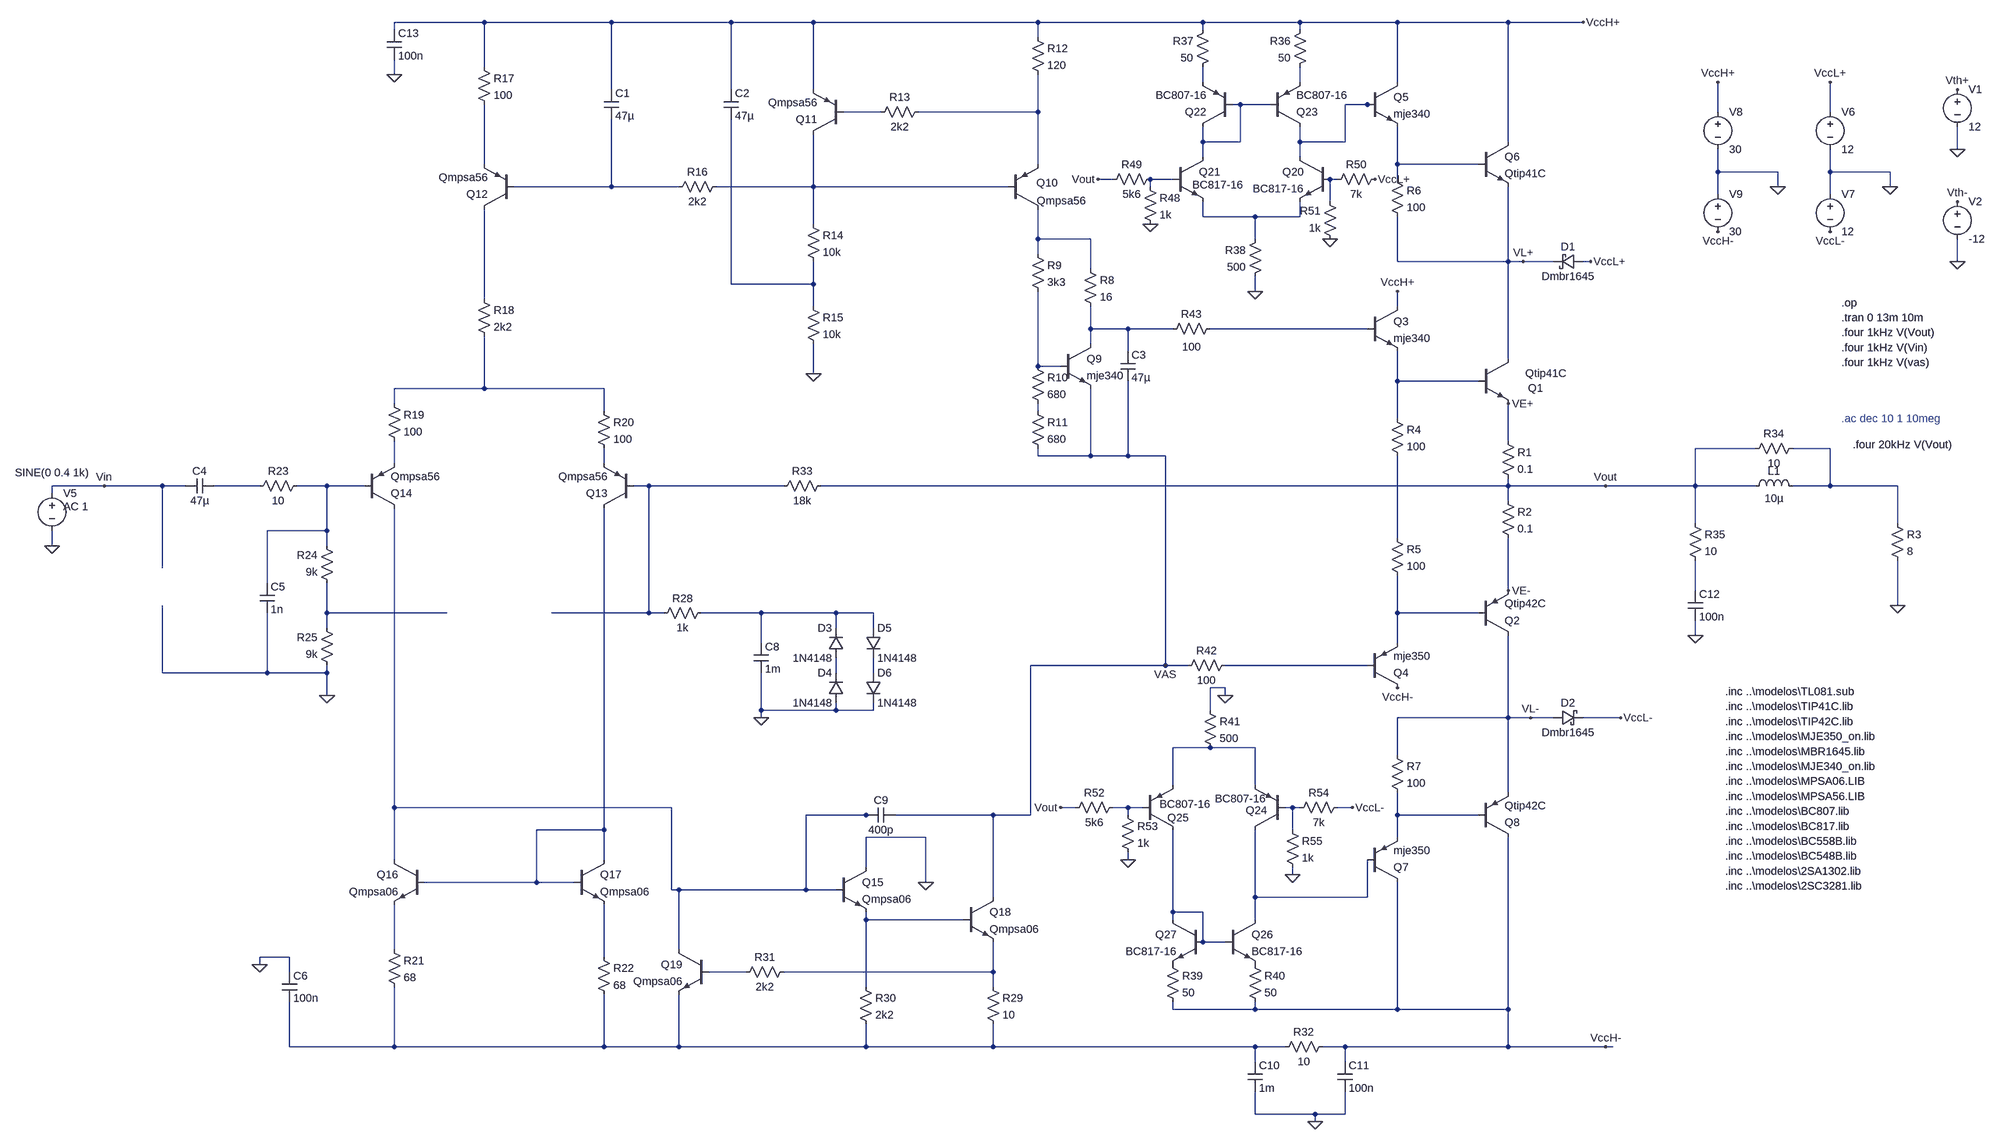
[diagram p0: schematic 3.1_cto_completo.asc]
3.1_cto_completo.asc, the LTspice schematic file:
Version 4
SHEET 1 1432 1652
WIRE -1984 -720 -2176 -720
WIRE -1712 -720 -1984 -720
WIRE -1456 -720 -1712 -720
WIRE -1280 -720 -1456 -720
WIRE -800 -720 -1280 -720
WIRE -448 -720 -800 -720
WIRE -240 -720 -448 -720
WIRE -32 -720 -240 -720
WIRE 240 -720 -32 -720
WIRE 400 -720 240 -720
WIRE -2176 -704 -2176 -720
WIRE -448 -704 -448 -720
WIRE -240 -704 -240 -720
WIRE -800 -688 -800 -720
WIRE -1984 -624 -1984 -720
WIRE -2176 -608 -2176 -640
WIRE -448 -592 -448 -624
WIRE -240 -592 -240 -624
WIRE -32 -592 -32 -720
WIRE -1712 -576 -1712 -720
WIRE -1456 -576 -1456 -720
WIRE -1280 -576 -1280 -720
WIRE -800 -544 -800 -608
WIRE -368 -544 -384 -544
WIRE -304 -544 -368 -544
WIRE -96 -544 -144 -544
WIRE -80 -544 -96 -544
WIRE -1136 -528 -1216 -528
WIRE -960 -528 -1056 -528
WIRE -800 -528 -800 -544
WIRE -800 -528 -960 -528
WIRE 688 -528 688 -592
WIRE 928 -528 928 -592
WIRE -448 -464 -448 -496
WIRE -368 -464 -368 -544
WIRE -368 -464 -448 -464
WIRE -240 -464 -240 -496
WIRE -224 -464 -240 -464
WIRE -144 -464 -144 -544
WIRE -144 -464 -224 -464
WIRE 240 -464 240 -720
WIRE 1200 -448 1200 -496
WIRE -448 -432 -448 -464
WIRE -240 -432 -240 -464
WIRE -1984 -416 -1984 -544
WIRE -800 -416 -800 -528
WIRE -32 -416 -32 -496
WIRE 64 -416 -32 -416
WIRE 176 -416 64 -416
WIRE 688 -400 688 -448
WIRE 816 -400 688 -400
WIRE 928 -400 928 -448
WIRE 1056 -400 928 -400
WIRE -640 -384 -672 -384
WIRE -528 -384 -560 -384
WIRE -512 -384 -528 -384
WIRE -160 -384 -176 -384
WIRE -32 -384 -32 -416
WIRE -1712 -368 -1712 -512
WIRE -1712 -368 -1920 -368
WIRE -1568 -368 -1712 -368
WIRE -1280 -368 -1280 -480
WIRE -1280 -368 -1488 -368
WIRE -864 -368 -1280 -368
WIRE -560 -368 -560 -384
WIRE -176 -368 -176 -384
WIRE 816 -368 816 -400
WIRE 1056 -368 1056 -400
WIRE 688 -352 688 -400
WIRE 928 -352 928 -400
WIRE -176 -336 -176 -368
WIRE -240 -320 -240 -336
WIRE -448 -304 -448 -336
WIRE -336 -304 -448 -304
WIRE -240 -304 -240 -320
WIRE -240 -304 -336 -304
WIRE -1280 -288 -1280 -368
WIRE -336 -272 -336 -304
WIRE -800 -256 -800 -320
WIRE -688 -256 -800 -256
WIRE -336 -256 -336 -272
WIRE -800 -224 -800 -256
WIRE -32 -208 -32 -304
WIRE 160 -208 -32 -208
WIRE 240 -208 240 -368
WIRE 240 -208 160 -208
WIRE 272 -208 240 -208
WIRE 336 -208 272 -208
WIRE 416 -208 400 -208
WIRE 1200 -208 1200 -256
WIRE -688 -192 -688 -256
WIRE -1456 -160 -1456 -512
WIRE -1280 -160 -1280 -208
WIRE -1280 -160 -1456 -160
WIRE -336 -144 -336 -176
WIRE -1984 -128 -1984 -320
WIRE -1280 -112 -1280 -160
WIRE -32 -112 -32 -144
WIRE -688 -64 -688 -112
WIRE -608 -64 -688 -64
WIRE -512 -64 -608 -64
WIRE -224 -64 -432 -64
WIRE -96 -64 -224 -64
WIRE -688 -32 -688 -64
WIRE -608 -16 -608 -64
WIRE 240 0 240 -208
WIRE -800 16 -800 -144
WIRE -752 16 -800 16
WIRE -1280 32 -1280 -32
WIRE -32 48 -32 -16
WIRE 80 48 -32 48
WIRE 176 48 80 48
WIRE -1984 64 -1984 -48
WIRE -1984 64 -2176 64
WIRE -1728 64 -1984 64
WIRE -2176 96 -2176 64
WIRE -1728 112 -1728 64
WIRE -800 112 -800 96
WIRE -32 128 -32 48
WIRE 240 160 240 96
WIRE 240 176 240 160
WIRE 768 192 640 192
WIRE 928 192 848 192
WIRE -800 208 -800 192
WIRE -688 208 -688 64
WIRE -688 208 -800 208
WIRE -608 208 -608 48
WIRE -608 208 -688 208
WIRE -528 208 -608 208
WIRE -2176 224 -2176 176
WIRE -1728 224 -1728 192
WIRE -2816 272 -2928 272
WIRE -2672 272 -2816 272
WIRE -2624 272 -2672 272
WIRE -2464 272 -2560 272
WIRE -2320 272 -2384 272
WIRE -2240 272 -2320 272
WIRE -1632 272 -1664 272
WIRE -1344 272 -1632 272
WIRE 240 272 240 256
WIRE 240 272 -1264 272
WIRE 320 272 240 272
WIRE 448 272 320 272
WIRE 640 272 640 192
WIRE 640 272 448 272
WIRE 768 272 640 272
WIRE 928 272 928 192
WIRE 928 272 848 272
WIRE 1072 272 928 272
WIRE -2928 288 -2928 272
WIRE 240 304 240 272
WIRE 640 352 640 272
WIRE 1072 352 1072 272
WIRE -2320 368 -2320 272
WIRE -2320 368 -2448 368
WIRE -32 384 -32 208
WIRE -2928 400 -2928 368
WIRE -2320 400 -2320 368
WIRE 240 432 240 384
WIRE -2672 448 -2672 272
WIRE -2448 480 -2448 368
WIRE 240 496 240 432
WIRE 640 496 640 432
WIRE 1072 528 1072 432
WIRE -2320 544 -2320 480
WIRE -2064 544 -2320 544
WIRE -1632 544 -1632 272
WIRE -1632 544 -1840 544
WIRE -1600 544 -1632 544
WIRE -1392 544 -1520 544
WIRE -1232 544 -1392 544
WIRE -1152 544 -1232 544
WIRE -32 544 -32 464
WIRE 80 544 -32 544
WIRE 176 544 80 544
WIRE -2320 576 -2320 544
WIRE -1232 576 -1232 544
WIRE -1152 576 -1152 544
WIRE 640 592 640 560
WIRE -1392 608 -1392 544
WIRE -32 608 -32 544
WIRE -528 656 -528 208
WIRE -528 656 -816 656
WIRE -480 656 -528 656
WIRE -96 656 -400 656
WIRE -2672 672 -2672 528
WIRE -2448 672 -2448 544
WIRE -2448 672 -2672 672
WIRE -2320 672 -2320 656
WIRE -2320 672 -2448 672
WIRE -1232 672 -1232 640
WIRE -1152 672 -1152 640
WIRE -400 704 -432 704
WIRE -2320 720 -2320 672
WIRE -400 720 -400 704
WIRE -1392 752 -1392 672
WIRE -1232 752 -1232 736
WIRE -1232 752 -1392 752
WIRE -1152 752 -1152 736
WIRE -1152 752 -1232 752
WIRE -432 752 -432 704
WIRE -1392 768 -1392 752
WIRE 64 768 -32 768
WIRE 240 768 240 592
WIRE 240 768 64 768
WIRE 288 768 240 768
WIRE 336 768 288 768
WIRE 480 768 400 768
WIRE -432 832 -512 832
WIRE -336 832 -432 832
WIRE -512 848 -512 832
WIRE -336 848 -336 832
WIRE -32 848 -32 768
WIRE -512 912 -512 848
WIRE -336 912 -336 848
WIRE 240 928 240 768
WIRE -2176 960 -2176 320
WIRE -1584 960 -2176 960
WIRE -720 960 -752 960
WIRE -608 960 -640 960
WIRE -576 960 -608 960
WIRE -256 960 -272 960
WIRE -240 960 -256 960
WIRE -128 960 -160 960
WIRE -1168 976 -1296 976
WIRE -1152 976 -1168 976
WIRE -896 976 -1104 976
WIRE -816 976 -816 656
WIRE -816 976 -896 976
WIRE -608 976 -608 960
WIRE -32 976 -32 928
WIRE 48 976 -32 976
WIRE 176 976 48 976
WIRE -1728 1008 -1728 320
WIRE -1728 1008 -1872 1008
WIRE -256 1008 -256 960
WIRE -1040 1024 -1168 1024
WIRE -32 1024 -32 976
WIRE -2176 1072 -2176 960
WIRE -1728 1072 -1728 1008
WIRE -608 1072 -608 1056
WIRE -1168 1088 -1168 1024
WIRE -256 1104 -256 1088
WIRE -1872 1120 -1872 1008
WIRE -1872 1120 -2112 1120
WIRE -1792 1120 -1872 1120
WIRE -1040 1120 -1040 1024
WIRE -1584 1136 -1584 960
WIRE -1568 1136 -1584 1136
WIRE -1296 1136 -1296 976
WIRE -1296 1136 -1568 1136
WIRE -1232 1136 -1296 1136
WIRE -896 1152 -896 976
WIRE -336 1152 -336 1008
WIRE -96 1152 -96 1072
WIRE -96 1152 -336 1152
WIRE -512 1184 -512 1008
WIRE -448 1184 -512 1184
WIRE -1168 1200 -1168 1184
WIRE -960 1200 -1168 1200
WIRE -512 1200 -512 1184
WIRE -336 1200 -336 1152
WIRE -448 1248 -448 1184
WIRE -400 1248 -448 1248
WIRE -2176 1264 -2176 1168
WIRE -1568 1264 -1568 1136
WIRE -2400 1280 -2464 1280
WIRE -1728 1280 -1728 1168
WIRE -2464 1296 -2464 1280
WIRE -2400 1312 -2400 1280
WIRE -1424 1312 -1504 1312
WIRE -896 1312 -896 1248
WIRE -896 1312 -1344 1312
WIRE -1168 1344 -1168 1200
WIRE -896 1344 -896 1312
WIRE -512 1392 -512 1376
WIRE -336 1392 -336 1376
WIRE -336 1392 -512 1392
WIRE -32 1392 -32 1120
WIRE -32 1392 -336 1392
WIRE 240 1392 240 1024
WIRE 240 1392 -32 1392
WIRE -2400 1472 -2400 1376
WIRE -2176 1472 -2176 1344
WIRE -2176 1472 -2400 1472
WIRE -1728 1472 -1728 1360
WIRE -1728 1472 -2176 1472
WIRE -1568 1472 -1568 1360
WIRE -1568 1472 -1728 1472
WIRE -1168 1472 -1168 1424
WIRE -1168 1472 -1568 1472
WIRE -896 1472 -896 1424
WIRE -896 1472 -1168 1472
WIRE -336 1472 -896 1472
WIRE -272 1472 -336 1472
WIRE -144 1472 -192 1472
WIRE 240 1472 240 1392
WIRE 240 1472 -144 1472
WIRE 448 1472 240 1472
WIRE 464 1472 448 1472
WIRE -336 1504 -336 1472
WIRE -144 1504 -144 1472
WIRE -336 1616 -336 1568
WIRE -208 1616 -336 1616
WIRE -144 1616 -144 1568
WIRE -144 1616 -208 1616
WIRE -208 1632 -208 1616
FLAG 1072 528 0
FLAG -2928 400 0
FLAG 448 272 Vout
FLAG -2816 272 Vin
FLAG 816 -368 0
FLAG 688 -592 VccH+
FLAG 688 -272 VccH-
FLAG 400 -720 VccH+
FLAG 448 1472 VccH-
FLAG 1056 -368 0
FLAG 928 -592 VccL+
FLAG 928 -272 VccL-
FLAG 416 -208 VccL+
FLAG 480 768 VccL-
FLAG 1200 -448 0
FLAG 1200 -576 Vth+
FLAG 1200 -208 0
FLAG 1200 -336 Vth-
FLAG -1280 32 0
FLAG -2320 720 0
FLAG -2464 1296 0
FLAG -1392 768 0
FLAG -1040 1120 0
FLAG -208 1632 0
FLAG -528 656 VAS
FLAG 640 592 0
FLAG -2176 -608 0
FLAG -32 -144 VccH+
FLAG -32 704 VccH-
FLAG 240 96 VE+
FLAG 240 496 VE-
FLAG -80 -384 VccL+
FLAG -672 -384 Vout
FLAG -560 -288 0
FLAG -176 -256 0
FLAG -336 -144 0
FLAG -128 960 VccL-
FLAG -752 960 Vout
FLAG -608 1072 0
FLAG -256 1104 0
FLAG -400 720 0
FLAG 272 -208 VL+
FLAG 288 768 VL-
DATAFLAG 320 272 ""
DATAFLAG 240 160 "round(Ie(Q1)*10k)/10k"
DATAFLAG 240 432 "round(Ie(Q2)*10k)/10k"
DATAFLAG 80 48 ""
DATAFLAG 80 544 ""
DATAFLAG 64 768 ""
DATAFLAG 160 -208 ""
DATAFLAG -896 976 ""
DATAFLAG -960 -528 ""
DATAFLAG -800 -544 "I(R12)"
DATAFLAG -336 -304 ""
DATAFLAG -240 -320 "round(10k*Ie(Q12))/10k"
DATAFLAG -224 -464 ""
DATAFLAG -528 -384 ""
DATAFLAG -176 -368 ""
DATAFLAG -336 -272 "round(I(R19)*10k)/10k"
DATAFLAG -512 848 ""
DATAFLAG -336 848 "Ie(Q16)"
DATAFLAG 64 -416 ""
DATAFLAG -224 -64 ""
DATAFLAG 48 976 ""
SYMBOL npn 176 0 R0
WINDOW 3 100 31 Left 2
WINDOW 0 106 63 Left 2
SYMATTR Value Qtip41C
SYMATTR InstName Q1
SYMBOL npn -96 -112 R0
SYMATTR InstName Q3
SYMATTR Value mje340
SYMBOL pnp 176 592 M180
SYMATTR InstName Q2
SYMATTR Value Qtip42C
SYMBOL res 224 160 R0
SYMATTR InstName R1
SYMATTR Value 0.1
SYMBOL res 224 288 R0
SYMATTR InstName R2
SYMATTR Value 0.1
SYMBOL res 1056 336 R0
SYMATTR InstName R3
SYMATTR Value 8
SYMBOL pnp -96 704 M180
SYMATTR InstName Q4
SYMATTR Value mje350
SYMBOL res -48 112 R0
SYMATTR InstName R4
SYMATTR Value 100
SYMBOL res -48 368 R0
SYMATTR InstName R5
SYMATTR Value 100
SYMBOL voltage -2928 272 R0
WINDOW 3 -79 -28 Left 2
WINDOW 123 24 44 Left 2
WINDOW 39 0 0 Left 2
SYMATTR Value SINE(0 0.4 1k)
SYMATTR Value2 AC 1
SYMATTR InstName V5
SYMBOL res -48 -400 R0
SYMATTR InstName R6
SYMATTR Value 100
SYMBOL npn -96 -592 R0
SYMATTR InstName Q5
SYMATTR Value mje340
SYMBOL npn 176 -464 R0
SYMATTR InstName Q6
SYMATTR Value Qtip41C
SYMBOL schottky 400 -224 R90
WINDOW 0 0 32 VBottom 2
WINDOW 3 32 32 VTop 2
SYMATTR InstName D1
SYMATTR Value Dmbr1645
SYMBOL schottky 336 784 R270
WINDOW 0 32 32 VTop 2
WINDOW 3 0 32 VBottom 2
SYMATTR InstName D2
SYMATTR Value Dmbr1645
SYMBOL pnp 176 1024 M180
SYMATTR InstName Q8
SYMATTR Value Qtip42C
SYMBOL pnp -96 1120 M180
SYMATTR InstName Q7
SYMATTR Value mje350
SYMBOL res -48 832 R0
SYMATTR InstName R7
SYMATTR Value 100
SYMBOL voltage 688 -544 R0
WINDOW 123 0 0 Left 2
WINDOW 39 0 0 Left 2
SYMATTR InstName V8
SYMATTR Value 30
SYMBOL voltage 688 -368 R0
WINDOW 123 0 0 Left 2
WINDOW 39 0 0 Left 2
SYMATTR InstName V9
SYMATTR Value 30
SYMBOL voltage 928 -544 R0
WINDOW 123 0 0 Left 2
WINDOW 39 0 0 Left 2
SYMATTR InstName V6
SYMATTR Value 12
SYMBOL voltage 928 -368 R0
WINDOW 123 0 0 Left 2
WINDOW 39 0 0 Left 2
SYMATTR InstName V7
SYMATTR Value 12
SYMBOL voltage 1200 -592 R0
WINDOW 123 0 0 Left 2
WINDOW 39 0 0 Left 2
SYMATTR InstName V1
SYMATTR Value 12
SYMBOL voltage 1200 -352 R0
WINDOW 123 0 0 Left 2
WINDOW 39 0 0 Left 2
SYMATTR InstName V2
SYMATTR Value -12
SYMBOL npn -752 -32 R0
SYMATTR InstName Q9
SYMATTR Value mje340
SYMBOL res -704 -208 R0
SYMATTR InstName R8
SYMATTR Value 16
SYMBOL res -816 -240 R0
SYMATTR InstName R9
SYMATTR Value 3k3
SYMBOL res -816 0 R0
SYMATTR InstName R10
SYMATTR Value 680
SYMBOL res -816 96 R0
SYMATTR InstName R11
SYMATTR Value 680
SYMBOL pnp -864 -320 M180
WINDOW 0 60 56 Left 2
WINDOW 3 61 18 Left 2
SYMATTR InstName Q10
SYMATTR Value Qmpsa56
SYMBOL res -816 -704 R0
SYMATTR InstName R12
SYMATTR Value 120
SYMBOL res -1040 -544 R90
WINDOW 0 0 56 VBottom 2
WINDOW 3 32 56 VTop 2
SYMATTR InstName R13
SYMATTR Value 2k2
SYMBOL pnp -1216 -480 R180
SYMATTR InstName Q11
SYMATTR Value Qmpsa56
SYMBOL res -1296 -304 R0
SYMATTR InstName R14
SYMATTR Value 10k
SYMBOL res -1296 -128 R0
SYMATTR InstName R15
SYMATTR Value 10k
SYMBOL res -1472 -384 R90
WINDOW 0 0 56 VBottom 2
WINDOW 3 32 56 VTop 2
SYMATTR InstName R16
SYMATTR Value 2k2
SYMBOL cap -1728 -576 R0
SYMATTR InstName C1
SYMATTR Value 47µ
SYMBOL cap -1472 -576 R0
SYMATTR InstName C2
SYMATTR Value 47µ
SYMBOL cap -624 -16 R0
SYMATTR InstName C3
SYMATTR Value 47µ
SYMBOL res -2000 -640 R0
SYMATTR InstName R17
SYMATTR Value 100
SYMBOL pnp -1920 -320 R180
SYMATTR InstName Q12
SYMATTR Value Qmpsa56
SYMBOL res -2000 -144 R0
SYMATTR InstName R18
SYMATTR Value 2k2
SYMBOL res -2192 80 R0
SYMATTR InstName R19
SYMATTR Value 100
SYMBOL res -1744 96 R0
SYMATTR InstName R20
SYMATTR Value 100
SYMBOL pnp -1664 320 R180
SYMATTR InstName Q13
SYMATTR Value Qmpsa56
SYMBOL pnp -2240 320 M180
SYMATTR InstName Q14
SYMATTR Value Qmpsa56
SYMBOL res -2192 1248 R0
SYMATTR InstName R21
SYMATTR Value 68
SYMBOL res -1744 1264 R0
SYMATTR InstName R22
SYMATTR Value 68
SYMBOL cap -2560 256 R90
WINDOW 0 0 32 VBottom 2
WINDOW 3 32 32 VTop 2
SYMATTR InstName C4
SYMATTR Value 47µ
SYMBOL res -2368 256 R90
WINDOW 0 0 56 VBottom 2
WINDOW 3 32 56 VTop 2
SYMATTR InstName R23
SYMATTR Value 10
SYMBOL res -2304 496 R180
WINDOW 0 36 76 Left 2
WINDOW 3 36 40 Left 2
SYMATTR InstName R24
SYMATTR Value 9k
SYMBOL res -2304 672 R180
WINDOW 0 36 76 Left 2
WINDOW 3 36 40 Left 2
SYMATTR InstName R25
SYMATTR Value 9k
SYMBOL cap -2416 1312 R0
SYMATTR InstName C6
SYMATTR Value 100n
SYMBOL res -1504 528 R90
WINDOW 0 0 56 VBottom 2
WINDOW 3 32 56 VTop 2
SYMATTR InstName R28
SYMATTR Value 1k
SYMBOL cap -1408 608 R0
SYMATTR InstName C8
SYMATTR Value 1m
SYMBOL npn -1792 1072 R0
SYMATTR InstName Q17
SYMATTR Value Qmpsa06
SYMBOL npn -2112 1072 M0
SYMATTR InstName Q16
SYMATTR Value Qmpsa06
SYMBOL npn -1232 1088 R0
SYMATTR InstName Q15
SYMATTR Value Qmpsa06
SYMBOL npn -960 1152 R0
SYMATTR InstName Q18
SYMATTR Value Qmpsa06
SYMBOL res -912 1328 R0
SYMATTR InstName R29
SYMATTR Value 10
SYMBOL cap -1104 960 R90
WINDOW 0 0 32 VBottom 2
WINDOW 3 32 32 VTop 2
SYMATTR InstName C9
SYMATTR Value 400p
SYMBOL res -1184 1328 R0
SYMATTR InstName R30
SYMATTR Value 2k2
SYMBOL res -1328 1296 R90
WINDOW 0 0 56 VBottom 2
WINDOW 3 32 56 VTop 2
SYMATTR InstName R31
SYMATTR Value 2k2
SYMBOL npn -1504 1264 M0
SYMATTR InstName Q19
SYMATTR Value Qmpsa06
SYMBOL res -176 1456 R90
WINDOW 0 0 56 VBottom 2
WINDOW 3 32 56 VTop 2
SYMATTR InstName R32
SYMATTR Value 10
SYMBOL cap -352 1504 R0
SYMATTR InstName C10
SYMATTR Value 1m
SYMBOL cap -160 1504 R0
SYMATTR InstName C11
SYMATTR Value 100n
SYMBOL res -1248 256 R90
WINDOW 0 0 56 VBottom 2
WINDOW 3 32 56 VTop 2
SYMATTR InstName R33
SYMATTR Value 18k
SYMBOL ind 752 288 R270
WINDOW 0 32 56 VTop 2
WINDOW 3 5 56 VBottom 2
SYMATTR InstName L1
SYMATTR Value 10µ
SYMBOL res 864 176 R90
WINDOW 0 0 56 VBottom 2
WINDOW 3 32 56 VTop 2
SYMATTR InstName R34
SYMATTR Value 10
SYMBOL res 624 336 R0
SYMATTR InstName R35
SYMATTR Value 10
SYMBOL cap 624 496 R0
SYMATTR InstName C12
SYMATTR Value 100n
SYMBOL cap -2192 -704 R0
SYMATTR InstName C13
SYMATTR Value 100n
SYMBOL res -384 640 R90
WINDOW 0 0 56 VBottom 2
WINDOW 3 32 56 VTop 2
SYMATTR InstName R42
SYMATTR Value 100
SYMBOL res -416 -80 R90
WINDOW 0 0 56 VBottom 2
WINDOW 3 39 56 VTop 2
SYMATTR InstName R43
SYMATTR Value 100
SYMBOL res -224 -720 M0
SYMATTR InstName R36
SYMATTR Value 50
SYMBOL res -432 -720 M0
SYMATTR InstName R37
SYMATTR Value 50
SYMBOL npn -176 -432 M0
SYMATTR InstName Q20
SYMATTR Value BC817-16
SYMBOL npn -512 -432 R0
WINDOW 3 42 60 Left 2
SYMATTR Value BC817-16
SYMATTR InstName Q21
SYMBOL res -320 -272 M0
SYMATTR InstName R38
SYMATTR Value 500
SYMBOL pnp -384 -496 R180
SYMATTR InstName Q22
SYMATTR Value BC807-16
SYMBOL pnp -304 -496 M180
SYMATTR InstName Q23
SYMATTR Value BC807-16
SYMBOL res -576 -384 R0
SYMATTR InstName R48
SYMATTR Value 1k
SYMBOL res -544 -400 R90
WINDOW 0 0 56 VBottom 2
WINDOW 3 32 56 VTop 2
SYMATTR InstName R49
SYMATTR Value 5k6
SYMBOL res -64 -400 R90
WINDOW 0 0 56 VBottom 2
WINDOW 3 32 56 VTop 2
SYMATTR InstName R50
SYMATTR Value 7k
SYMBOL res -160 -240 R180
WINDOW 0 36 76 Left 2
WINDOW 3 36 40 Left 2
SYMATTR InstName R51
SYMATTR Value 1k
SYMBOL pnp -272 1008 R180
WINDOW 0 38 42 Left 2
WINDOW 3 41 67 Left 2
SYMATTR InstName Q24
SYMATTR Value BC807-16
SYMBOL pnp -576 1008 M180
WINDOW 0 52 26 Left 2
WINDOW 3 36 55 Left 2
SYMATTR InstName Q25
SYMATTR Value BC807-16
SYMBOL res -528 1280 R0
SYMATTR InstName R39
SYMATTR Value 50
SYMBOL res -352 1280 R0
SYMATTR InstName R40
SYMATTR Value 50
SYMBOL res -448 736 R0
SYMATTR InstName R41
SYMATTR Value 500
SYMBOL npn -400 1200 R0
SYMATTR InstName Q26
SYMATTR Value BC817-16
SYMBOL npn -448 1200 M0
SYMATTR InstName Q27
SYMATTR Value BC817-16
SYMBOL res -624 944 R90
WINDOW 0 0 56 VBottom 2
WINDOW 3 32 56 VTop 2
SYMATTR InstName R52
SYMATTR Value 5k6
SYMBOL res -624 960 R0
SYMATTR InstName R53
SYMATTR Value 1k
SYMBOL res -144 944 R90
WINDOW 0 0 56 VBottom 2
WINDOW 3 32 56 VTop 2
SYMATTR InstName R54
SYMATTR Value 7k
SYMBOL res -272 992 R0
SYMATTR InstName R55
SYMATTR Value 1k
SYMBOL diode -1216 640 R180
WINDOW 0 24 64 Left 2
WINDOW 3 24 0 Left 2
SYMATTR InstName D3
SYMATTR Value 1N4148
SYMBOL diode -1216 736 R180
WINDOW 0 24 64 Left 2
WINDOW 3 24 0 Left 2
SYMATTR InstName D4
SYMATTR Value 1N4148
SYMBOL diode -1168 576 R0
SYMATTR InstName D5
SYMATTR Value 1N4148
SYMBOL diode -1168 672 R0
SYMATTR InstName D6
SYMATTR Value 1N4148
SYMBOL cap -2464 480 R0
SYMATTR InstName C5
SYMATTR Value 1n
TEXT 952 -88 Left 2 !.tran 0 13m 10m
TEXT 952 -24 Left 2 !.four 1kHz V(Vin)
TEXT 952 -56 Left 2 !.four 1kHz V(Vout)
TEXT 952 -120 Left 2 !.op
TEXT 952 8 Left 2 !.four 1kHz V(vas)
TEXT 952 128 Left 2 ;.ac dec 10 1 10meg
TEXT 976 184 Left 2 !.four 20kHz V(Vout)
TEXT 704 1032 Left 2 !.inc ..\\modelos\\BC558B.lib
TEXT 704 1064 Left 2 !.inc ..\\modelos\\BC548B.lib
TEXT 704 968 Left 2 !.inc ..\\modelos\\BC807.lib
TEXT 704 1000 Left 2 !.inc ..\\modelos\\BC817.lib
TEXT 704 1096 Left 2 !.inc ..\\modelos\\2SA1302.lib
TEXT 704 1128 Left 2 !.inc ..\\modelos\\2SC3281.lib
TEXT 704 904 Left 2 !.inc ..\\modelos\\MPSA06.LIB
TEXT 704 936 Left 2 !.inc ..\\modelos\\MPSA56.LIB
TEXT 704 712 Left 2 !.inc ..\\modelos\\TL081.sub
TEXT 704 744 Left 2 !.inc ..\\modelos\\TIP41C.lib
TEXT 704 776 Left 2 !.inc ..\\modelos\\TIP42C.lib
TEXT 704 872 Left 2 !.inc ..\\modelos\\MJE340_on.lib
TEXT 704 808 Left 2 !.inc ..\\modelos\\MJE350_on.lib
TEXT 704 840 Left 2 !.inc ..\\modelos\\MBR1645.lib

The netlist it stands for:
* 3.1_cto_completo.asc
Q1 VL+ N020 VE+ 0 Qtip41C
Q3 VccH+ N018 N020 0 mje340
Q2 VL- N033 VE- 0 Qtip42C
R1 VE+ Vout 0.1
R2 Vout VE- 0.1
R3 N023 0 8
Q4 VccH- N034 N033 0 mje350
R4 N020 N029 100
R5 N029 N033 100
V5 Vin 0 SINE(0 0.4 1k) AC 1
R6 N008 VL+ 100
Q5 VccH+ N005 N008 0 mje340
Q6 VccH+ N008 VL+ 0 Qtip41C
D1 VccL+ VL+ Dmbr1645
D2 VL- VccL- Dmbr1645
Q8 VccH- N041 VL- 0 Qtip42C
Q7 VccH- N043 N041 0 mje350
R7 VL- N041 100
V8 VccH+ 0 30
V9 0 VccH- 30
V6 VccL+ 0 12
V7 0 VccL- 12
V1 Vth+ 0 12
V2 Vth- 0 -12
Q9 N017 N019 VAS 0 mje340
R8 N014 N017 16
R9 N014 N019 3k3
R10 N019 N022 680
R11 N022 VAS 680
Q10 N014 N012 N003 0 Qmpsa56
R12 VccH+ N003 120
R13 N003 N006 2k2
Q11 N012 N006 VccH+ 0 Qmpsa56
R14 N012 N015 10k
R15 N015 0 10k
R16 N012 N011 2k2
C1 VccH+ N011 47µ
C2 VccH+ N015 47µ
C3 N017 VAS 47µ
R17 VccH+ N007 100
Q12 N016 N011 N007 0 Qmpsa56
R18 N016 N021 2k2
R19 N021 N024 100
R20 N021 N025 100
Q13 N042 N028 N025 0 Qmpsa56
Q14 N038 N027 N024 0 Qmpsa56
R21 N046 N050 68
R22 N047 N050 68
C4 N026 Vin 47µ
R23 N027 N026 10
R24 N031 N027 9k
R25 0 N031 9k
C6 0 N050 100n
R28 N032 N028 1k
C8 N032 0 1m
Q17 N042 N042 N047 0 Qmpsa06
Q16 N038 N042 N046 0 Qmpsa06
Q15 0 N038 N045 0 Qmpsa06
Q18 VAS N045 N049 0 Qmpsa06
R29 N049 N050 10
C9 VAS N038 400p
R30 N045 N050 2k2
R31 N049 N048 2k2
Q19 N038 N048 N050 0 Qmpsa06
R32 VccH- N050 10
C10 N050 0 1m
C11 VccH- 0 100n
R33 Vout N028 18k
L1 Vout N023 10µ
R34 N023 Vout 10
R35 Vout N030 10
C12 N030 0 100n
C13 VccH+ 0 100n
R42 N034 VAS 100
R43 N018 N017 100
R36 VccH+ N002 50
R37 VccH+ N001 50
Q20 N005 N010 N013 0 BC817-16
Q21 N004 N009 N013 0 BC817-16
R38 N013 0 500
Q22 N004 N004 N001 0 BC807-16
Q23 N005 N004 N002 0 BC807-16
R48 N009 0 1k
R49 N009 Vout 5k6
R50 VccL+ N010 7k
R51 0 N010 1k
Q24 N043 N040 N037 0 BC807-16
Q25 N044 N039 N037 0 BC807-16
R39 P001 VccH- 50
R40 P002 VccH- 50
R41 0 N037 500
Q26 N043 N044 P002 0 BC817-16
Q27 N044 N044 P001 0 BC817-16
R52 N039 Vout 5k6
R53 N039 0 1k
R54 VccL- N040 7k
R55 N040 0 1k
D3 N035 N032 1N4148
D4 0 N035 1N4148
D5 N032 N036 1N4148
D6 N036 0 1N4148
C5 N027 0 1n
.model D D
.lib standard.dio
.model NPN NPN
.model PNP PNP
.lib standard.bjt
.tran 0 13m 10m
.four 1kHz V(Vin)
.four 1kHz V(Vout)
.op
.four 1kHz V(vas)
* .ac dec 10 1 10meg
.four 20kHz V(Vout)
.inc ..\modelos\BC558B.lib
.inc ..\modelos\BC548B.lib
.inc ..\modelos\BC807.lib
.inc ..\modelos\BC817.lib
.inc ..\modelos\2SA1302.lib
.inc ..\modelos\2SC3281.lib
.inc ..\modelos\MPSA06.LIB
.inc ..\modelos\MPSA56.LIB
.inc ..\modelos\TL081.sub
.inc ..\modelos\TIP41C.lib
.inc ..\modelos\TIP42C.lib
.inc ..\modelos\MJE340_on.lib
.inc ..\modelos\MJE350_on.lib
.inc ..\modelos\MBR1645.lib
.backanno
.end